# EAGLE design Projektarbeit (EAGLE 9.6.2)
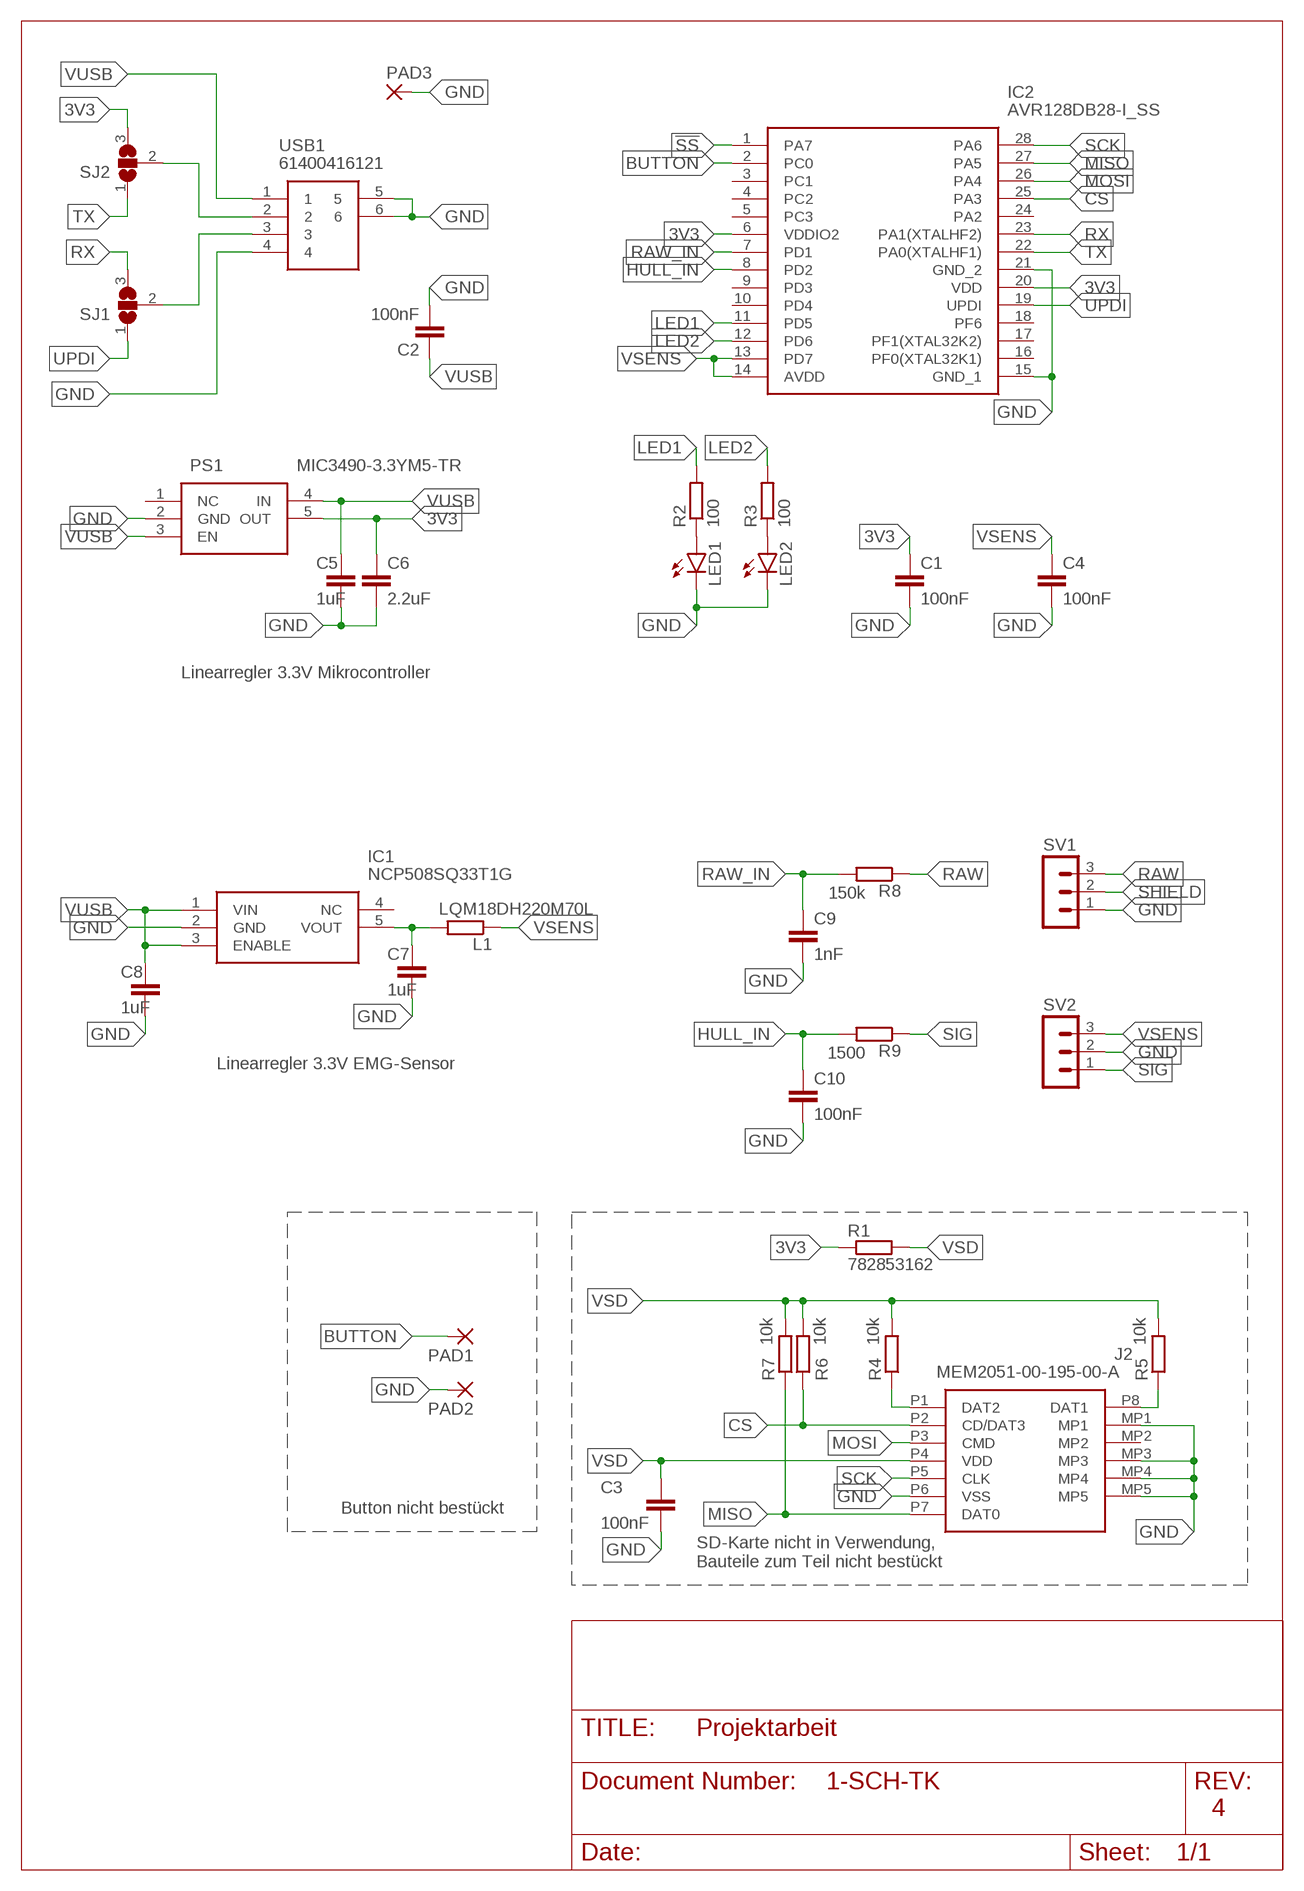
[diagram p0: schematic, sheet 1]

## Parts
C1  100nF  C-EUC0603  [C0603]
C2  100nF  C-EUC0603  [C0603]
C3  100nF  C-EUC0603  [C0603]
C4  100nF  C-EUC0603  [C0603]
C5  1uF  C-EUC0603  [C0603]
C6  2.2uF  C-EUC0603  [C0603]
C7  1uF  C-EUC0603  [C0603]
C8  1uF  C-EUC0603  [C0603]
C9  1nF  C-EUC0603  [C0603]
C10  100nF  C-EUC0603  [C0603]
IC1  NCP508SQ33T1G  [SOT65P210X110-5N]
IC2  AVR128DB28-I_SS  [SOP65P780X200-28N]
J2  MEM2051-00-195-00-A  [MEM20510019500A]
L1  LQM18DH220M70L  R-EU_R0603  [R0603]
LED1  LEDCHIPLED_0805  [CHIPLED_0805]
LED2  LEDCHIPLED_0805  [CHIPLED_0805]
PAD1  2,15/1,0  [2,15/1,0]
PAD2  2,15/1,0  [2,15/1,0]
PAD3  2,54/0,9  [2,54/0,9]
PS1  MIC3490-3.3YM5-TR  [SOT95P280X145-5N]
R1  782853162  R-EU_R0805  [R0805]
R2  100  R-EU_R0603  [R0603]
R3  100  R-EU_R0603  [R0603]
R4  10k  R-EU_R0603  [R0603]
R5  10k  R-EU_R0603  [R0603]
R6  10k  R-EU_R0603  [R0603]
R7  10k  R-EU_R0603  [R0603]
R8  150k  R-EU_R0603  [R0603]
R9  1500  R-EU_R0603  [R0603]
SJ1  SJ2W  [SJ_2]
SJ2  SJ2W  [SJ_2]
SV1  MA03-1  [MA03-1]
SV2  MA03-1  [MA03-1]
USB1  61400416121  [61400416121]

## Nets
3V3: C1.1 C6.1 IC2.6(VDDIO2) IC2.20(VDD) PS1.5(OUT) R1.1 SJ2.3
!SS: IC2.1(PA7)
BUTTON: IC2.2(PC0) PAD1.1(P)
CS: IC2.25(PA3) J2.P2(CD/DAT3) R6.1
GND: C1.2 C2.2 C3.2 C4.2 C5.2 C6.2 C7.2 C8.2 C9.2 C10.2 IC1.2(GND) IC2.15(GND_1) IC2.21(GND_2) J2.MP1 J2.MP3 J2.MP4 J2.MP5 J2.P6(VSS) LED1.C LED2.C PAD2.1(P) PAD3.1(P) PS1.2(GND) SV1.1 SV2.2 USB1.4 USB1.5 USB1.6
HULL_IN: C10.1 IC2.8(PD2) R9.2
LED1: IC2.11(PD5) R2.2
LED2: IC2.12(PD6) R3.2
MISO: IC2.27(PA5) J2.P7(DAT0) R7.1
MOSI: IC2.26(PA4) J2.P3(CMD)
N$1: SJ1.2 USB1.3
N$2: SJ2.2 USB1.2
N$3: C7.1 IC1.5(VOUT) L1.2
N$4: LED1.A R2.1
N$5: J2.P1(DAT2) R4.1
N$6: J2.P8(DAT1) R5.1
N$7: LED2.A R3.1
RAW: R8.1 SV1.3
RAW_IN: C9.1 IC2.7(PD1) R8.2
RX: IC2.23(PA1(XTALHF2)) SJ1.3
SCK: IC2.28(PA6) J2.P5(CLK)
SHIELD: SV1.2
SIG: R9.1 SV2.1
TX: IC2.22(PA0(XTALHF1)) SJ2.1
UPDI: IC2.19(UPDI) SJ1.1
VSD: C3.1 J2.P4(VDD) R1.2 R4.2 R5.2 R6.2 R7.2
VSENS: C4.1 IC2.13(PD7) IC2.14(AVDD) L1.1 SV2.3
VUSB: C2.1 C5.1 C8.1 IC1.1(VIN) IC1.3(ENABLE) PS1.3(EN) PS1.4(IN) USB1.1
Unconnected: IC1.4(NC) IC2.3(PC1) IC2.4(PC2) IC2.5(PC3) IC2.9(PD3) IC2.10(PD4) IC2.16(PF0(XTAL32K1)) IC2.17(PF1(XTAL32K2)) IC2.18(PF6) IC2.24(PA2) J2.MP2 PS1.1(NC)

## Notes on the sheet
- Linearregler 3.3V Mikrocontroller
- Linearregler 3.3V EMG-Sensor
- Button nicht bestückt
- SD-Karte nicht in Verwendung,
  Bauteile zum Teil nicht bestückt
- 1-SCH-TK
- 4

## Library data of the parts
C1-C10 = rcl:C-EU: CAPACITOR, European symbol; SPICEPREFIX: C
IC1 = SamacSys_Parts:NCP508SQ33T1G: ON SEMICONDUCTOR - NCP508SQ33T1G - LDO, FIXED, 3.3V, 0.05A, SC-70-5 Source: Datasheet <https://www.onsemi.com/pub/Collateral/NCP508-D.PDF>; ARROW_PART_NUMBER: NCP508SQ33T1G; ARROW_PRICE-STOCK: https://www.arrow.com/en/products/ncp508sq33t1g/on-semiconductor; DESCRIPTION: ON SEMICONDUCTOR - NCP508SQ33T1G - LDO, FIXED, 3.3V, 0.05A, SC-70-5; HEIGHT: 1.1mm; MANUFACTURER_NAME: ON Semiconductor; MANUFACTURER_PART_NUMBER: NCP508SQ33T1G; MOUSER_PART_NUMBER: 863-NCP508SQ33T1G; MOUSER_PRICE-STOCK: https://www.mouser.co.uk/ProductDetail/ON-Semiconductor/NCP508SQ33T1G?qs=mB5q98eOMcbu%252B7lsN7E1tA%3D%3D
IC2 = SamacSys_Parts:AVR128DB28-I_SS: 8-bit Microcontrollers - MCU 128KB, SSOP28, 85C, 24MHz, 12b ADC, Comp, Opamp, MVIO, ZCD, DAC, UART, SPI, TWI Source: Datasheet <https://ww1.microchip.com/downloads/en/DeviceDoc/AVR128DB28-32-48-64-DataSheet-DS40002247A.pdf>; DESCRIPTION: 8-bit Microcontrollers - MCU 128KB, SSOP28, 85C, 24MHz, 12b ADC, Comp, Opamp, MVIO, ZCD, DAC, UART, SPI, TWI; HEIGHT: 2mm; MANUFACTURER_NAME: Microchip; MANUFACTURER_PART_NUMBER: AVR128DB28-I/SS; MOUSER_PART_NUMBER: 579-AVR128DB28-I/SS; MOUSER_PRICE-STOCK: https://www.mouser.co.uk/ProductDetail/Microchip-Technology/AVR128DB28-I-SS?qs=vmHwEFxEFR8FrzxFVS97CA%3D%3D
J2 = SamacSys_Parts:MEM2051-00-195-00-A: MICRO SD PUSH PUSH, OPEN, SMT, 1 Source: Datasheet <https://gct.co/files/drawings/mem2051.pdf>; DESCRIPTION: MICRO SD PUSH PUSH, OPEN, SMT, 1; HEIGHT: 2.05mm; MANUFACTURER_NAME: GCT (GLOBAL CONNECTOR TECHNOLOGY); MANUFACTURER_PART_NUMBER: MEM2051-00-195-00-A; MOUSER_PART_NUMBER: 640-MEM20510019500A; MOUSER_PRICE-STOCK: https://www.mouser.co.uk/ProductDetail/GCT/MEM2051-00-195-00-A?qs=KUoIvG%2F9Ilat7yfJRNWXUQ%3D%3D
L1 R1-R9 = rcl:R-EU_: RESISTOR, European symbol; SPICEPREFIX: R
LED1 LED2 = led:LED: LED OSRAM: - CHIPLED LG R971, LG N971, LY N971, LG Q971, LY Q971, LO R971, LY R971 LH N974, LH R974 LS Q976, LO Q976, LY Q976 LO Q996 - Hyper CHIPLED LW Q18S LB Q993, LB Q99A, LB R99A - SideLED LS A670, LO A670, LY A670, LG A670, LP A670 LB A673, LV A673, LT A673, LW A673 LH A674 LY A675 LS A676, LA A676, LO A676, LY A676, LW A676 LS A679, LY A679, LG A679 - Hyper Micro SIDELED® LS Y876, LA Y876, LO Y876, LY Y876 LT Y87S - SmartLED LW L88C, LW L88S LB L89C, LB L89S, LG L890 LS L89K, LO L89K, LY L89K LS L896, LA L896, LO L896, LY L896 - TOPLED LS T670, LO T670, LY T670, LG T670, LP T670 LSG T670, LSP T670, LSY T670, LOP T670, LYG T670 LG T671, LOG T671, LSG T671 LB T673, LV T673, LT T673, LW T673 LH T674 LS T676, LA T676, LO T676, LY T676, LB T676, LH T676, LSB T676, LW T676 LB T67C, LV T67C, LT T67C, LS T67K, LO T67K, LY T67K, LW E67C LS E67B, LA E67B, LO E67B, LY E67B, LB E67C, LV E67C, LT E67C LW T67C LS T679, LY T679, LG T679 LS T770, LO T770, LY T770, LG T770, LP T770 LB T773, LV T773, LT T773, LW T773 LH T774 LS E675, LA E675, LY E675, LS T675 LS T776, LA T776, LO T776, LY T776, LB T776 LHGB T686 LT T68C, LB T68C - Hyper Mini TOPLED® LB M676 - Mini TOPLED Santana® LG M470 LS M47K, LO M47K, LY M47K Source: http://www.osram.convergy.de LUXEON: - LUMILED® LXK2-PW12-R00, LXK2-PW12-S00, LXK2-PW14-U00, LXK2-PW14-V00 LXK2-PM12-R00, LXK2-PM12-S00, LXK2-PM14-U00 LXK2-PE12-Q00, LXK2-PE12-R00, LXK2-PE12-S00, LXK2-PE14-T00, LXK2-PE14-U00 LXK2-PB12-K00, LXK2-PB12-L00, LXK2-PB12-M00, LXK2-PB14-N00, LXK2-PB14-P00, LXK2-PB14-Q00 LXK2-PR12-L00, LXK2-PR12-M00, LXK2-PR14-Q00, LXK2-PR14-R00 LXK2-PD12-Q00, LXK2-PD12-R00, LXK2-PD12-S00 LXK2-PH12-R00, LXK2-PH12-S00 LXK2-PL12-P00, LXK2-PL12-Q00, LXK2-PL12-R00 Source: www.luxeon.com KINGBRIGHT: KA-3528ASYC Source: www.kingbright.com
PAD1 PAD2 = wirepad:2,15/1,0: THROUGH-HOLE PAD
PAD3 = wirepad:2,54/0,9: THROUGH-HOLE PAD
PS1 = SamacSys_Parts:MIC3490-3.3YM5-TR: LDO Voltage Regulators High Vin, Low Iq Regulator Source: Datasheet <http://ww1.microchip.com/downloads/en/DeviceDoc/MIC3490-Data-Sheet-DS20006137A.pdf>; ARROW_PART_NUMBER: MIC3490-3.3YM5-TR; ARROW_PRICE-STOCK: https://www.arrow.com/en/products/mic3490-3.3ym5-tr/microchip-technology; DESCRIPTION: LDO Voltage Regulators High Vin, Low Iq Regulator; HEIGHT: 1.45mm; MANUFACTURER_NAME: Microchip; MANUFACTURER_PART_NUMBER: MIC3490-3.3YM5-TR; MOUSER_PART_NUMBER: 579-MIC349033YM5TR; MOUSER_PRICE-STOCK: https://www.mouser.co.uk/ProductDetail/Microchip-Technology/MIC3490-33YM5-TR?qs=3HJ2avRr9PK7lROkJk02cg%3D%3D
SJ1 SJ2 = jumper:SJ2W: SMD solder JUMPER
SV1 SV2 = con-lstb:MA03-1: PIN HEADER; OC_FARNELL: unknown; OC_NEWARK: unknown
USB1 = SamacSys_Parts:61400416121: WR-COM USB Connector B horizontal Wurth Elektronik Right Angle PCB Mount Mount Female Type B USB Connector, 30 V ac, 1.5A Source: Datasheet <http://docs-emea.rs-online.com/webdocs/1023/0900766b81023ab5.pdf>; DESCRIPTION: WR-COM USB Connector B horizontal Wurth Elektronik Right Angle PCB Mount Mount Female Type B USB Connector, 30 V ac, 1.5A; HEIGHT: mm; MANUFACTURER_NAME: Wurth Elektronik; MANUFACTURER_PART_NUMBER: 61400416121; MOUSER_PART_NUMBER: 710-61400416121; MOUSER_PRICE-STOCK: https://www.mouser.com/Search/Refine.aspx?Keyword=710-61400416121; RS_PART_NUMBER: 7480866P; RS_PRICE-STOCK: http://uk.rs-online.com/web/p/products/7480866P

## Board
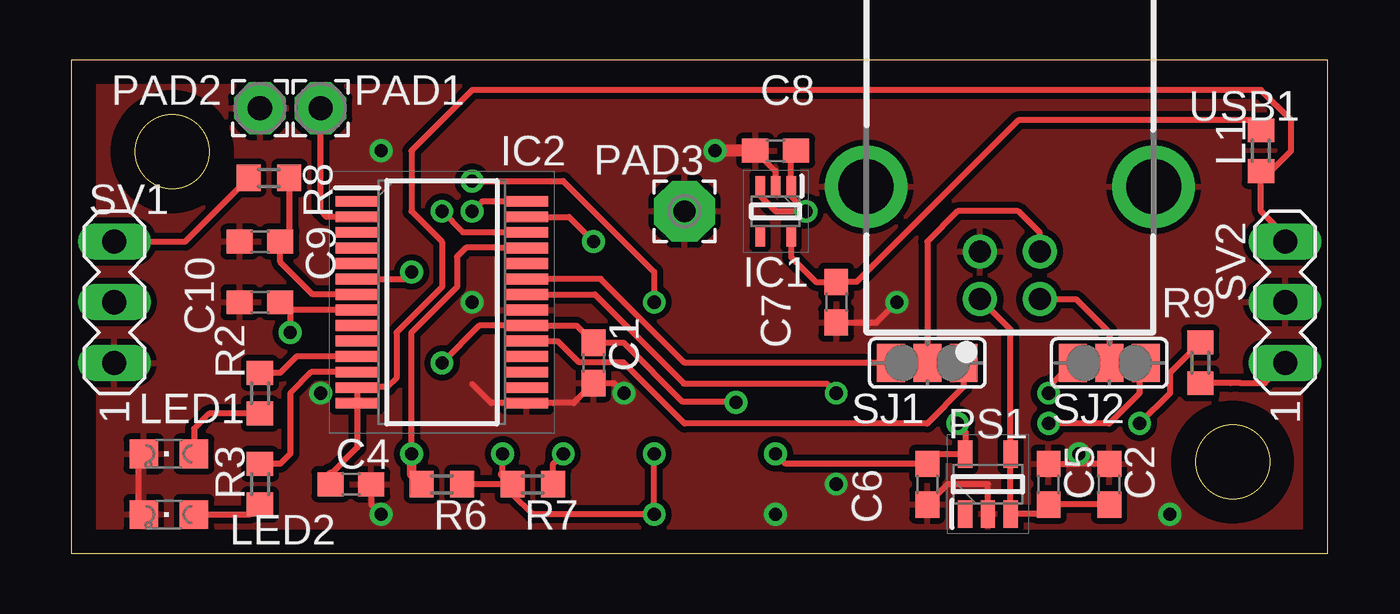
[diagram p1: board, top side]
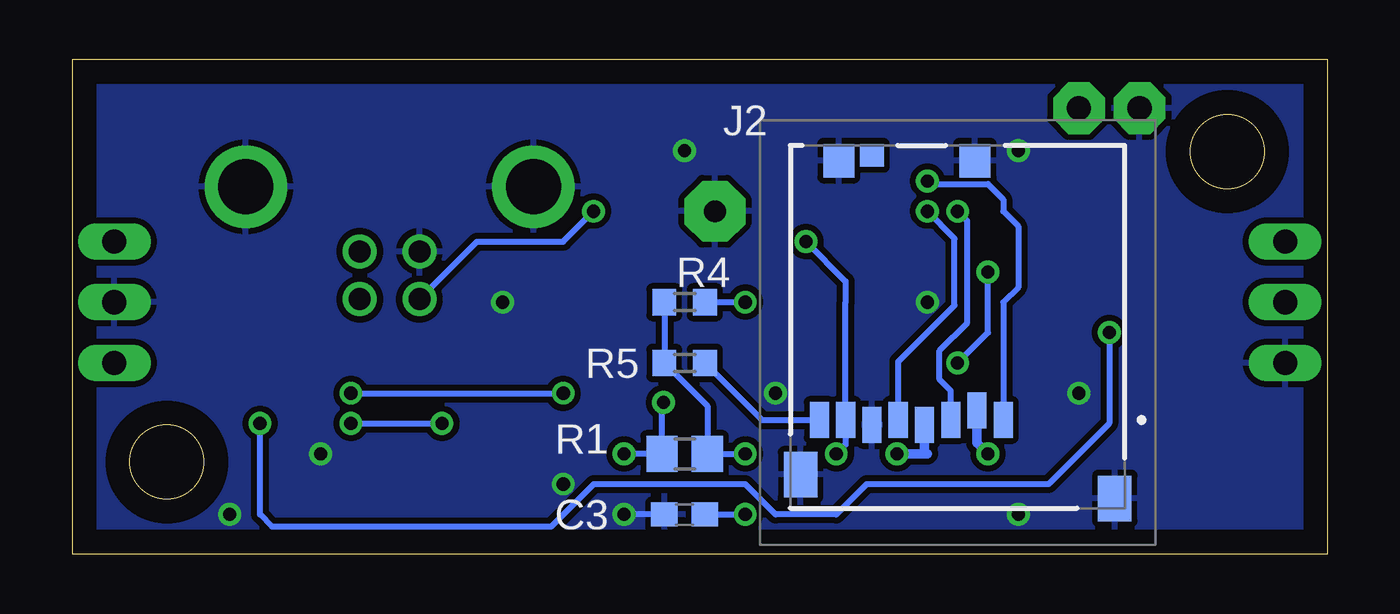
[diagram p2: board, bottom side, seen from below]

Size 52.55 x 20.7 mm. Coordinates in mm from the lower left corner, seen from the top.
Outline: 0,20.7 52.55,20.7 52.55,0 0,0 0,20.7
Outline: circle at 4.2,16.85 radius 1.55
Outline: circle at 48.6,3.85 radius 1.55
Copper layers (1*16): Top 0.035mm / dielectric 1.5mm / Bottom 0.035mm
Design rules "default": minimum track width 6mil, minimum drill 0.35mm, track to track 6mil, track to pad 6mil, pad to pad 6mil, via to via 6mil, smd to smd 6mil, copper to edge 40mil, drill to drill 6mil, minimum pad ring 10mil, minimum via ring 8mil, stop-mask expansion 4mil, vias tented up to drill 0mil, thermal gap 10mil

### Footprints (pad centres in the part's own frame; a part is rotated, then mirrored left to right if it is on the bottom)
C0603 = smd 1.1 x 1: 1 -0.85,0; 2 0.85,0
SOT65P210X110-5N = smd 0.85 x 0.4: 1 -1.05,0.65; 2 -1.05,0; 3 -1.05,-0.65; 4 1.05,-0.65; 5 1.05,0.65
SOP65P780X200-28N = smd 1.8 x 0.45: 1 -3.55,4.225; 2 -3.55,3.575; 3 -3.55,2.925; 4 -3.55,2.275; 5 -3.55,1.625; 6 -3.55,0.975; 7 -3.55,0.325; 8 -3.55,-0.325; 9 -3.55,-0.975; 10 -3.55,-1.625; 11 -3.55,-2.275; 12 -3.55,-2.925; 13 -3.55,-3.575; 14 -3.55,-4.225; 15 3.55,-4.225; 16 3.55,-3.575; 17 3.55,-2.925; 18 3.55,-2.275; 19 3.55,-1.625; 20 3.55,-0.975; 21 3.55,-0.325; 22 3.55,0.325; 23 3.55,0.975; 24 3.55,1.625; 25 3.55,2.275; 26 3.55,2.925; 27 3.55,3.575; 28 3.55,4.225
MEM20510019500A = smd 1.3 x 1.4: MP1 -4.975,7.199; MP3 0.725,7.199 | smd 1 x 0.95: MP2 -3.585,7.425 | smd 1.4 x 1.9: MP4 -6.575,-5.95; MP5 6.575,-6.95 | smd 0.8 x 1.5: P1 1.915,-3.661; P2 0.815,-3.261; P3 -0.285,-3.661; P4 -1.385,-3.861; P5 -2.485,-3.661; P6 -3.585,-3.861; P7 -4.685,-3.661; P8 -5.785,-3.661
R0603 = smd 1 x 1.1: 1 -0.85,0; 2 0.85,0
CHIPLED_0805 = smd 1.2 x 1.2: A 0,-1.05; C 0,1.05
2,15/1,0 = drill 1.016 pad 2.159 octagon: 1 0,0
2,54/0,9 = drill 0.914 pad 2.54 octagon: 1 0,0
SOT95P280X145-5N = smd 1.15 x 0.6: 1 -1.25,0.95; 2 -1.25,0; 3 -1.25,-0.95; 4 1.25,-0.95; 5 1.25,0.95
R0805 = smd 1.3 x 1.5: 1 -0.95,0; 2 0.95,0
SJ_2 = smd 1.168 x 1.6: 1 -1.524,0; 2 0,0; 3 1.524,0
MA03-1 = drill 1.016 long: 1 -2.54,0; 2 0,0; 3 2.54,0
61400416121 = drill 0.92 pad 1.42: 1 4.75,-15.11; 2 7.25,-15.11; 3 7.25,-13.11; 4 4.75,-13.11 | drill 2.3 pad 3.45: 5 -0.02,-10.4; 6 12.02,-10.4

### Placement (x,y rotation side)
C1  21.84,8 270 top
C2  43.43,2.92 90 top
C3  26.92,1.65 180 bottom
C4  11.68,2.92 0 top
C5  40.89,2.92 90 top
C6  35.81,2.92 270 top
C7  32,10.54 270 top
C8  29.46,16.89 180 top
C9  7.87,13.08 180 top
C10  7.87,10.54 180 top
IC1  29.46,14.35 270 top
IC2  15.49,10.54 0 top
J2  15.49,9.27 0 bottom
L1  49.78,16.89 90 top
LED1  4.06,4.19 90 top
LED2  4.06,1.65 90 top
PAD1  10.41,18.67 0 top
PAD2  7.87,18.67 0 top
PAD3  25.65,14.35 0 top
PS1  38.35,2.92 90 top
R1  26.92,4.19 0 bottom
R2  7.87,6.73 90 top
R3  7.87,2.92 90 top
R4  26.92,10.54 180 bottom
R5  26.92,8 180 bottom
R6  15.49,2.92 0 top
R7  19.3,2.92 180 top
R8  8.25,15.75 0 top
R9  47.24,8 90 top
SJ1  35.81,8 180 top
SJ2  43.43,8 0 top
SV1  1.78,10.54 90 top
SV2  50.8,10.54 90 top
USB1  33.27,25.78 0 top

### Tracks (layer width: path | path; a pad name or v marks a point on that pad's centre or on a via)
3V3  (via drill 0.55)
  Top 0.254: v29.46,4.19 29.88,3.77 C6.1 36.21,4.17 PS1.5 37.4,5.14 v37.08,5.46 | v27.81,6.35 27.79,6.37 25.57,6.37 23.09,8.85 C1.1 21.13,9.56 IC2.20 17.06,9.56 v15.49,8 | SJ2.3 44.7,7.75 44.7,6.73 43.43,5.46 v40.89,5.46 | IC2.6 13.93,11.51 v14.22,11.81
  Bottom 0.254: 28.19,4.19 v29.46,4.19 | R1.1 27.87,6.29 v27.81,6.35 | v40.89,5.46 v37.08,5.46 | v15.49,8 14.22,9.27 v14.22,11.81
  Bottom 0.406: R1.1 28.19,4.19
BUTTON
  Top 0.254: PAD1.1 10.41,14.35 10.65,14.11 IC2.2
CS  (via drill 0.55)
  Top 0.254: IC2.25 17.77,12.81 17.76,12.83 16.51,12.83 16.13,12.44 16.13,11.17 14.22,9.27 v14.22,4.19
  Top 0.406: R6.1 14.22,3.34 v14.22,4.19
  Bottom 0.406: J2.P2 14.68,4.64 v14.22,4.19
GND  (via drill 0.55)
  Top 0.254: C4.2 12.53,2.07 v12.95,1.65 | 2.79,1.87 2.79,4.41 | 16.76,7.11 17.56,6.31 IC2.15 21.01,6.31 C1.2 22.69,7.15 v23.11,6.73 | PS1.2 38.35,2.92 36.66,2.92 C6.2 | C7.2 33.69,9.69 v34.54,10.54 | C2.2 42.16,3.77 | C5.2 42.16,3.77 | 42.16,3.77 v42.16,4.19 | C8.2 29.46,16.04 IC1.2
  Top 0.508: C8.2 v26.92,16.89 | 2.79,4.41 LED1.C | LED2.C 2.79,1.87
  Bottom 0.254: C3.2 v29.46,1.65
  other vias: 16.76,10.54 10.41,6.73 45.97,1.65 32,2.92 12.95,16.89
  pour Bottom (isolate 0.254): 0.25,20.7 52.32,20.7 52.32,0.38 0.25,0.38
  pour Top (isolate 0.254): 0.25,20.7 52.32,20.7 52.32,0.38 0.25,0.38
HULL_IN  (via drill 0.55)
  Top 0.254: IC2.8 9.14,10.21 | 9.14,10.21 9.05,10.21 C10.1 | R9.2 45.97,7.58 45.97,6.73 v44.7,5.46 | 9.14,10.21 v9.14,9.27
  Bottom 0.254: v9.14,9.27 9.14,5.46 11.68,2.92 19.3,2.92 20.57,1.65 23.11,1.65 24.38,2.92 30.73,2.92 32.51,1.14 44.2,1.14 44.7,1.65 v44.7,5.46
LED1
  Top 0.254: IC2.11 9.41,8.26 8.72,7.58 R2.2
LED2
  Top 0.254: IC2.12 10.03,7.61 9.14,6.73 9.14,4.19 8.72,3.77 R3.2
MISO  (via drill 0.55)
  Top 0.254: R7.1 20.15,3.77 v20.57,4.19 | IC2.27 20.81,14.11 v21.84,13.08
  Bottom 0.254: v20.57,4.19 20.18,4.59 J2.P7 20.18,10.54 20.18,11.41 v21.84,13.08
MOSI  (via drill 0.55)
  Top 0.254: IC2.26 16.38,13.46 v15.49,14.35
  Bottom 0.254: v15.49,14.35 15.09,13.94 15.09,9.68 16.25,8.51 16.25,7.3 15.78,6.83 J2.P3
N$1
  Top 0.254: USB1.3 40.52,13.45 39.62,14.35 37.08,14.35 35.81,13.08 SJ1.2
N$2
  Top 0.254: USB1.2 42.03,10.67 43.43,9.27 SJ2.2
N$3
  Top 0.254: L1.2 49.36,18.16 39.62,18.16 32.85,11.39 C7.1 31.15,11.39 30.11,12.43 IC1.5
N$4
  Top 0.254: R2.1 5.75,5.88 5.11,5.24 LED1.A
N$5  (via drill 0.55)
  Top 0.254: v24.38,10.54 24.38,11.81 20.57,15.62 v16.76,15.62
  Bottom 0.254: v16.76,15.62 16.63,15.49 14.22,15.49 13.58,14.84 13.58,14.35 12.95,13.72 12.95,11.16 13.58,10.54 J2.P1 | R4.1 v24.38,10.54
N$6
  Bottom 0.254: R5.1 23.68,5.61 J2.P8
N$7
  Top 0.254: R3.1 7.45,1.65 LED2.A
RAW
  Top 0.254: SV1.3 4.74,13.08 R8.1
RAW_IN
  Top 0.254: IC2.7 10.09,10.86 8.72,12.23 C9.1 9.14,13.5 9.11,13.54 R8.2
RX
  Top 0.254: SJ1.3 25.65,8 22.14,11.51 IC2.23
SCK  (via drill 0.55)
  Top 0.254: IC2.28 17.18,14.77 v16.76,14.35
  Bottom 0.254: J2.P5 17.98,8.05 15.62,10.41 15.62,13.21 v16.76,14.35
SIG
  Top 0.254: R9.1 48.51,7.15 48.93,7.15 49.95,7.15 SV2.1
TX  (via drill 0.55)
  Top 0.254: IC2.22 21.9,10.86 25.63,7.14 31.6,7.14 v32,6.73 | SJ2.1 40.89,6.98 v40.89,6.73
  Bottom 0.254: v40.89,6.73 v32,6.73
UPDI
  Top 0.254: IC2.19 20.33,8.91 21.23,8.02 23.09,8.02 25.65,5.46 35.81,5.46 37.34,6.98 SJ1.1
VSD  (via drill 0.55)
  Top 0.254: R6.2 R7.2 18.45,2.5 19.3,1.65 v24.38,1.65 v24.38,4.19 | 18.03,3.34 v18.03,4.19
  Top 0.406: R7.2 18.03,3.34
  Bottom 0.254: C3.1 v24.38,1.65 | R4.2 R5.2 25.97,6.2 R1.2 v24.38,4.19
  Bottom 0.406: J2.P4 16.88,4.3 16.76,4.19 v18.03,4.19
VSENS
  Top 0.254: 10.83,3.34 11.94,4.45 IC2.14 IC2.13 11.96,6.98 13.21,6.98 13.59,7.36 13.59,9.27 15.49,11.17 15.49,13.08 14.22,14.35 14.22,16.89 16.76,19.43 49.78,19.43 51.05,18.16 51.05,16.89 50.2,16.04 L1.1 49.78,14.35 50.8,13.33 SV2.3
  Top 0.406: 10.83,3.34 C4.1
VUSB  (via drill 0.55)
  Top 0.254: C2.1 C5.1 40.49,1.67 PS1.3 PS1.4 39.3,9.39 USB1.1 | C8.1 30.11,16.69 IC1.1 30.11,14.97 v30.73,14.35 29.46,14.35 28.81,15 IC1.3
  Bottom 0.254: USB1.1 35.61,13.08 32,13.08 v30.73,14.35